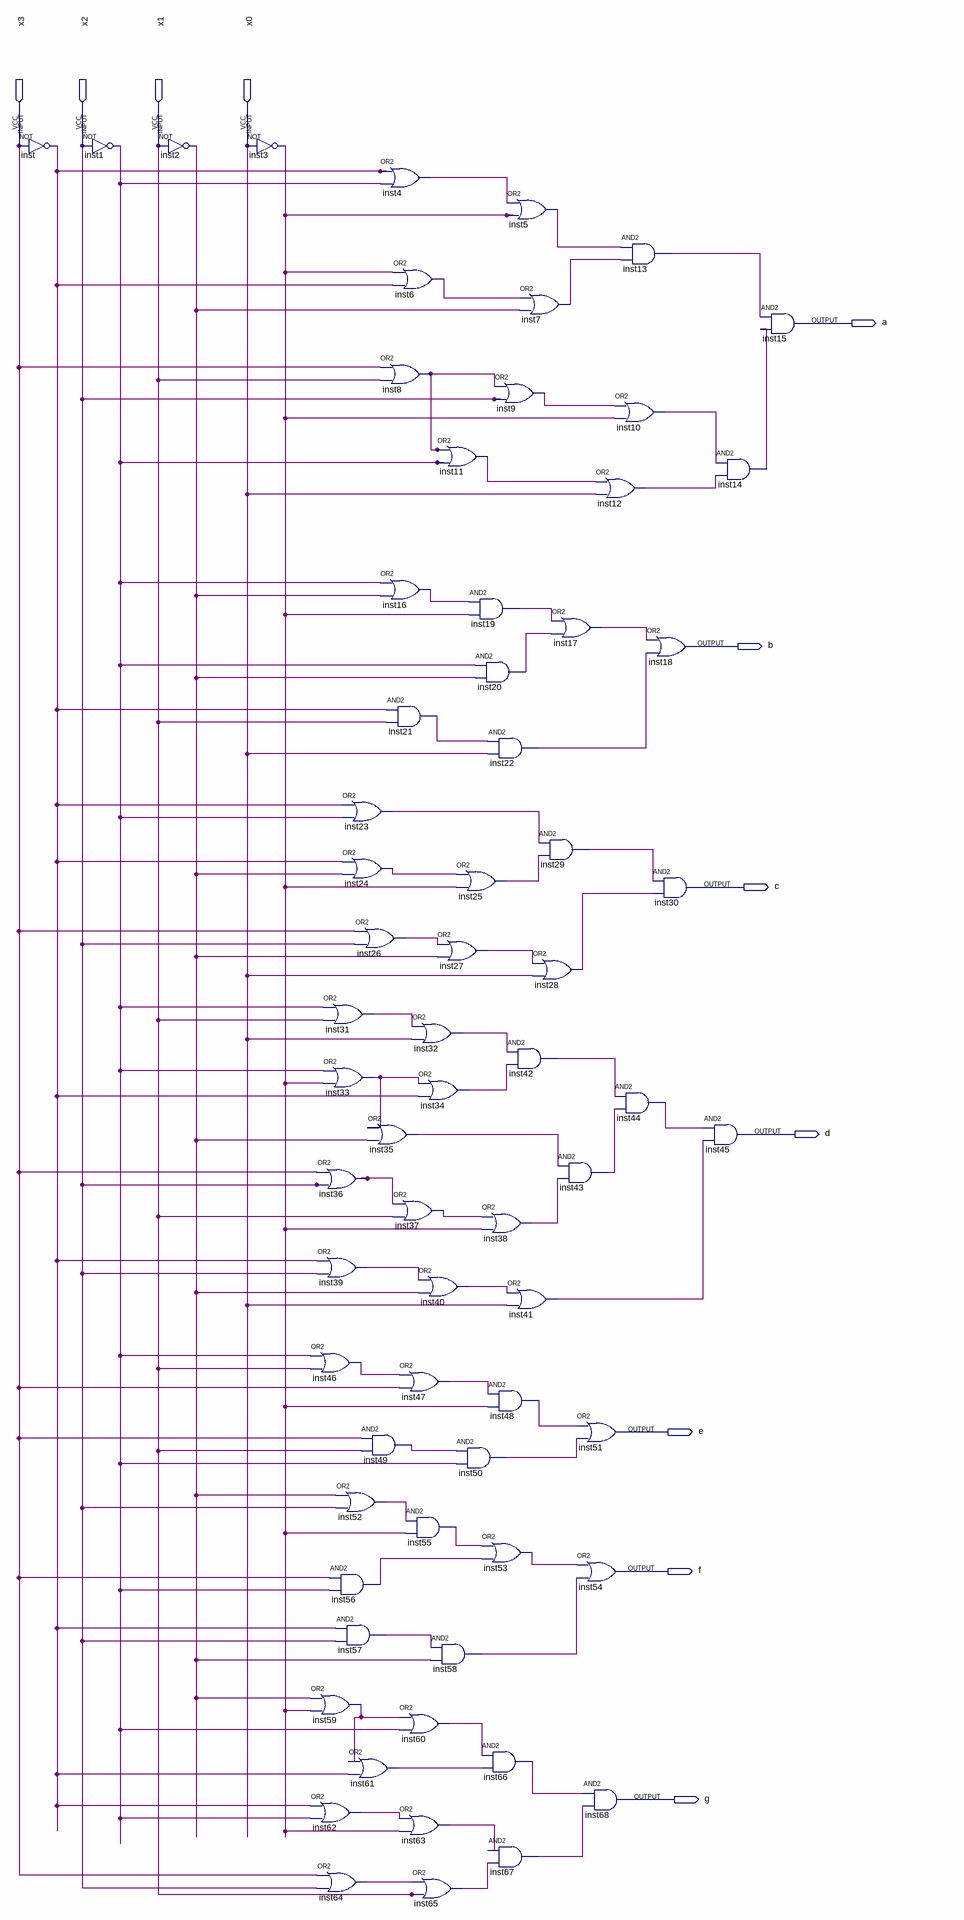
[diagram p0: schematic sheet]
// Quartus schematic dz1PORT.bdf as structural Verilog: 69 symbols, 11 pins
module dz1PORT (
  input  x3,
  input  x2,
  input  x1,
  input  x0,
  output a,
  output b,
  output c,
  output d,
  output e,
  output f,
  output g
);

  wire inst1_out, inst2_out, inst3_out, inst4_out, inst5_out, inst6_out, inst7_out, inst8_out, inst9_out,
       inst10_out, inst11_out, inst12_out, inst13_out, inst14_out, inst16_out, inst17_out, inst19_out,
       inst20_out, inst21_out, inst22_out, inst23_out, inst24_out, inst25_out, inst26_out, inst27_out,
       inst28_out, inst29_out, inst31_out, inst32_out, inst33_out, inst34_out, inst35_out, inst36_out,
       inst37_out, inst38_out, inst39_out, inst40_out, inst41_out, inst42_out, inst43_out, inst44_out,
       inst46_out, inst47_out, inst48_out, inst49_out, inst50_out, inst52_out, inst53_out, inst55_out,
       inst56_out, inst57_out, inst58_out, inst59_out, inst60_out, inst61_out, inst62_out, inst63_out,
       inst64_out, inst65_out, inst66_out, inst67_out, inst_out;

  not inst (inst_out, x3);
  not inst1 (inst1_out, x2);
  not inst2 (inst2_out, x1);
  not inst3 (inst3_out, x0);
  or inst46 (inst46_out, inst1_out, x1);
  or inst59 (inst59_out, inst2_out, inst3_out);
  or inst62 (inst62_out, inst_out, inst1_out);
  or inst23 (inst23_out, inst_out, inst1_out);
  or inst24 (inst24_out, inst_out, inst2_out);
  or inst26 (inst26_out, x3, x2);
  or inst31 (inst31_out, inst1_out, x1);
  or inst33 (inst33_out, inst1_out, inst3_out);
  or inst36 (inst36_out, x3, x2);
  or inst39 (inst39_out, inst_out, x2);
  and inst49 (inst49_out, x3, x1);
  or inst52 (inst52_out, inst2_out, x2);
  and inst56 (inst56_out, x3, inst1_out);
  and inst57 (inst57_out, inst_out, x2);
  buf inst61 (inst61_out, inst_out);  // OR2 open: IN1
  or inst64 (inst64_out, x3, x2);
  or inst4 (inst4_out, inst_out, inst1_out);
  or inst6 (inst6_out, inst3_out, inst_out);
  or inst8 (inst8_out, x3, x1);
  or inst16 (inst16_out, inst1_out, inst2_out);
  and inst21 (inst21_out, inst_out, x1);
  or inst32 (inst32_out, inst31_out, x0);
  or inst35 (inst35_out, inst33_out, inst2_out);
  or inst37 (inst37_out, inst36_out, x1);
  or inst47 (inst47_out, inst46_out, x3);
  and inst55 (inst55_out, inst52_out, inst3_out);
  or inst60 (inst60_out, inst59_out, inst1_out);
  or inst63 (inst63_out, inst62_out, inst3_out);
  or inst65 (inst65_out, inst64_out, x1);
  or inst11 (inst11_out, inst8_out, inst1_out);
  or inst25 (inst25_out, inst24_out, inst3_out);
  or inst27 (inst27_out, inst26_out, inst2_out);
  or inst34 (inst34_out, inst33_out, inst_out);
  or inst40 (inst40_out, inst39_out, inst2_out);
  and inst50 (inst50_out, inst49_out, inst1_out);
  and inst58 (inst58_out, inst57_out, inst2_out);
  or inst5 (inst5_out, inst4_out, inst3_out);
  or inst9 (inst9_out, inst8_out, x2);
  and inst19 (inst19_out, inst16_out, inst3_out);
  and inst20 (inst20_out, inst1_out, inst2_out);
  and inst22 (inst22_out, inst21_out, x0);
  and inst42 (inst42_out, inst32_out, inst34_out);
  or inst38 (inst38_out, inst37_out, inst3_out);
  or inst41 (inst41_out, inst40_out, x0);
  and inst48 (inst48_out, inst47_out, inst3_out);
  or inst53 (inst53_out, inst55_out, inst56_out);
  and inst66 (inst66_out, inst60_out, inst61_out);
  buf inst67 (inst67_out, inst65_out);  // AND2 open: IN1
  or inst7 (inst7_out, inst6_out, inst2_out);
  or inst17 (inst17_out, inst19_out, inst20_out);
  and inst29 (inst29_out, inst23_out, inst25_out);
  or inst28 (inst28_out, inst27_out, x0);
  and inst43 (inst43_out, inst35_out, inst38_out);
  or inst10 (inst10_out, inst9_out, inst3_out);
  or inst12 (inst12_out, inst11_out, x0);
  and inst44 (inst44_out, inst42_out, inst43_out);
  or inst51 (e, inst48_out, inst50_out);
  or inst54 (f, inst53_out, inst58_out);
  and inst68 (g, inst66_out, inst67_out);
  and inst13 (inst13_out, inst5_out, inst7_out);
  or inst18 (b, inst17_out, inst22_out);
  and inst30 (c, inst29_out, inst28_out);
  and inst14 (inst14_out, inst10_out, inst12_out);
  and inst45 (d, inst44_out, inst41_out);
  and inst15 (a, inst13_out, inst14_out);
endmodule
